# EAGLE design usb_power (EAGLE 7.7.0)
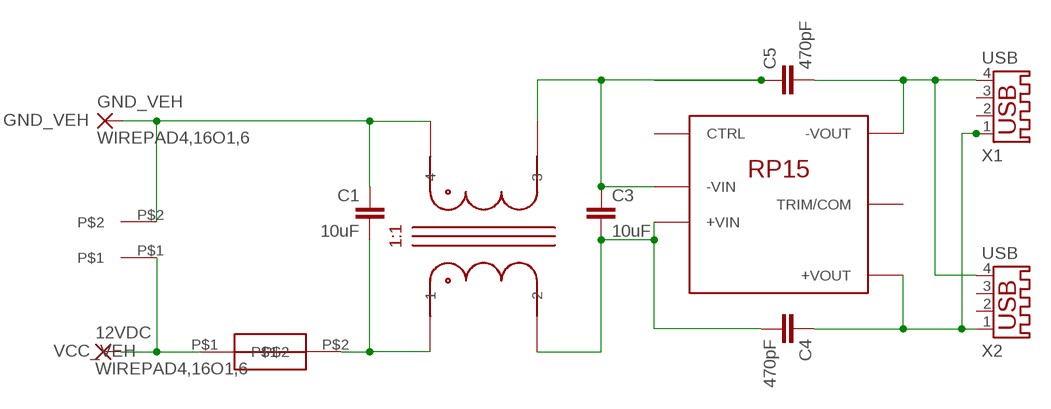
[diagram p0: schematic, sheet 1]

## Parts
12VDC  WIREPAD4,16O1,6  [4,16O1,6]
C1  10uF  C-EUC1812  [C1812]
C3  10uF  C-EUC1812  [C1812]
C4  470pF  C-EUC1808  [C1808]
C5  470pF  C-EUC1808  [C1808]
GND_VEH  WIREPAD4,16O1,6  [4,16O1,6]
RECOM  RP15-1205SA  [RP15]
U$2  1.6A  FUSE  [C1608]
U$3  COMMON-MODE-CHOKE  [CMS2]
U$4  POWERPOLE_RIGHT  [1336G1]
X1  USB  USB-A003  [USB-A003]
X2  USB  USB-A003  [USB-A003]

## Nets
GND_VEH: C1.1 GND_VEH.1(P) U$3.4 U$4.P$2
N$3: C1.2 U$2.P$2 U$3.1
N$4: C3.1 C5.1 RECOM.-VIN U$3.3
N$8: C3.2 C4.2 RECOM.+VIN U$3.2
N$12: C5.2 RECOM.-VOUT X1.4 X2.4
VCC_ISO: C4.1 RECOM.+VOUT X1.1 X2.1
VCC_VEH: 12VDC.1(P) U$2.P$1 U$4.P$1
Unconnected: RECOM.CTRL RECOM.TRIM/COM X1.2 X1.3 X2.2 X2.3

## Library data of the parts
12VDC GND_VEH = wirepad:WIREPAD: Wire PAD connect wire on PCB
C1 C3-C5 = resistor:C-EU: CAPACITOR, European symbol
RECOM = doug-custom:RP15-1205SA: RP15-1205SA isolated DC/DC converter 9-18 VDC input 5 VDC output, 3,000 mA / 15W max
U$2 = doug-custom:FUSE: FUSE
U$3 = doug-custom:COMMON-MODE-CHOKE: common mode choke Eaton CMS2 surface mount
U$4 = doug-custom:POWERPOLE_RIGHT: right angle powerpole connector, pcb mount
X1 X2 = con-yamaichi:USB-A003: USB connector; OC_FARNELL: unknown; OC_NEWARK: unknown

## Board
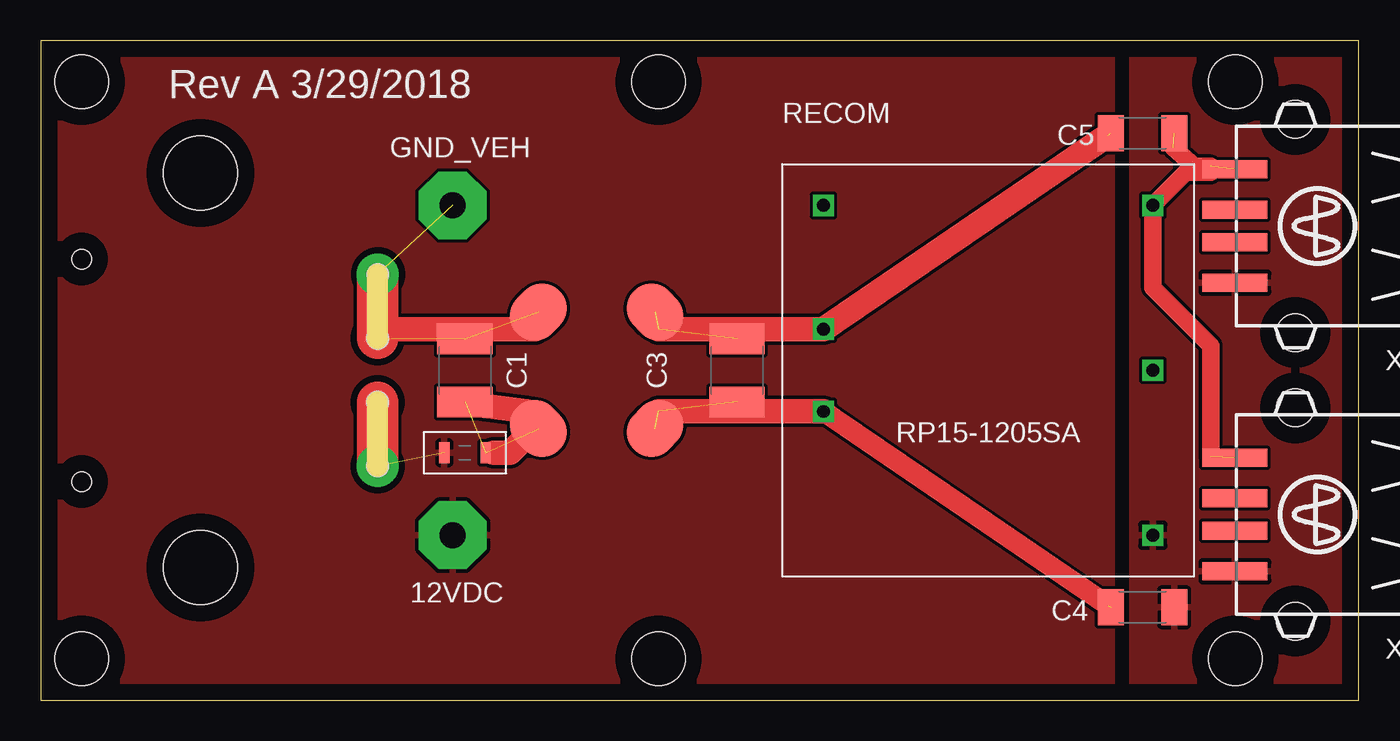
[diagram p1: board, top side]
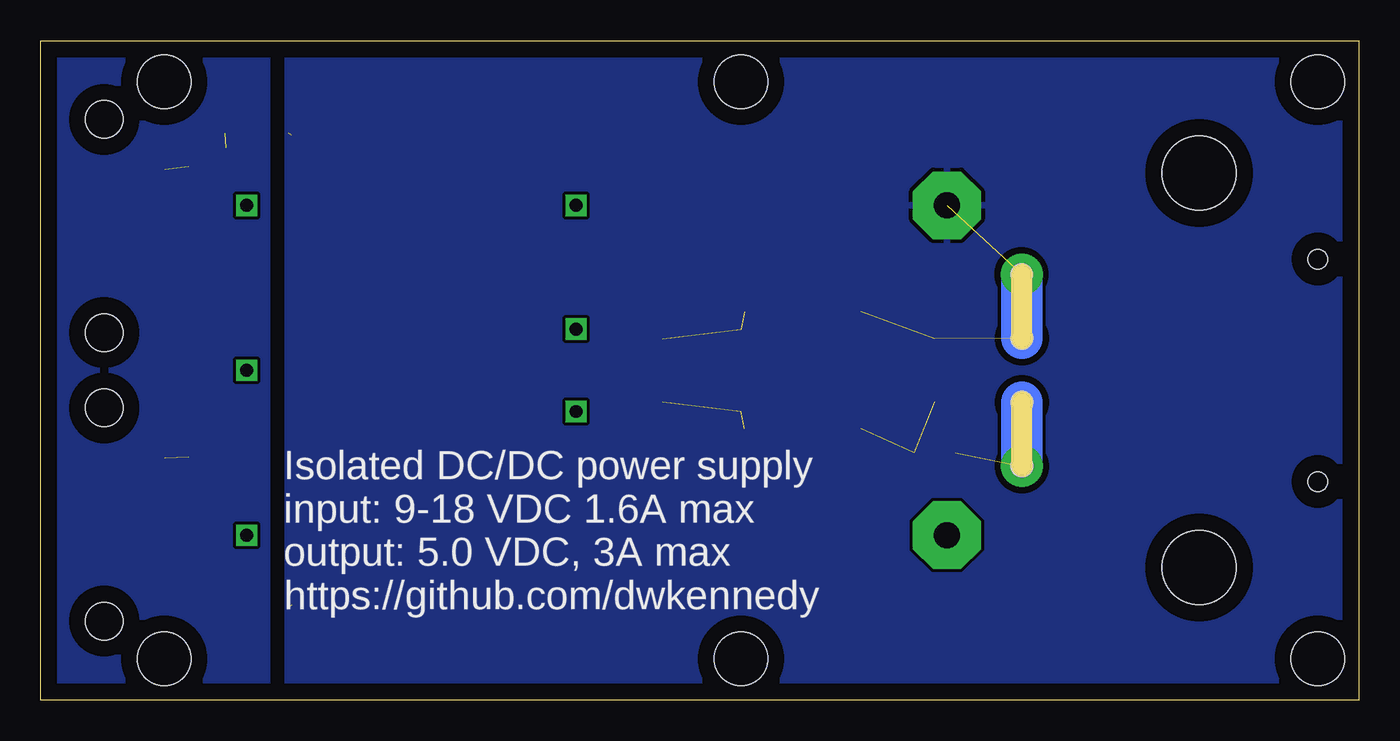
[diagram p2: board, bottom side, seen from below]

Size 81.28 x 40.64 mm. Coordinates in mm from the lower left corner, seen from the top.
Outline: 0,0 81.26,0 81.28,40.64 0,40.64 0,0
Copper layers (1*16): Top 0.035mm / dielectric 1.5mm / Bottom 0.035mm
Design rules "default": minimum track width 10mil, minimum drill 24mil, track to track 8mil, track to pad 8mil, pad to pad 8mil, via to via 8mil, smd to smd 8mil, copper to edge 40mil, drill to drill 8mil, minimum pad ring 10mil, minimum via ring 8mil, stop-mask expansion 4mil, vias tented up to drill 0mil, thermal gap 10mil
Holes 3.26 mm at 2.54,38.1 2.54,2.54 73.66,2.54 73.66,38.1 38.1,38.1 38.1,2.54

### Footprints (pad centres in the part's own frame; a part is rotated, then mirrored left to right if it is on the bottom)
4,16O1,6 = drill 1.6 pad 4.166 octagon: 1 0,0
C1812 = smd 1.9 x 3.4: 1 -1.95,0; 2 1.95,0
C1808 = smd 1.6 x 2.2: 1 -1.95,0; 2 1.95,0
RP15 = drill 0.8 square: +VIN -10.16,-2.54; +VOUT 10.16,-10.16; -VIN -10.16,2.54; -VOUT 10.16,10.16; CTRL -10.16,10.16; TRIM/COM 10.16,0
C1608 = smd 0.635 x 1.27: P$1 -1.27,0; P$2 1.27,0
CMS2 = smd 3.048 x 3.683: 1 -5.08,0; 3 5.08,0 | smd 3.683 x 3.048: 2 0,-5.08; 4 0,5.08
1336G1 = drill 1.3 pad 2.565: P$1 -5.905,-18.237; P$2 5.905,-18.237 | hole 1.3: -5.905,-18.237; -1.968,-18.237; 1.968,-18.237; 5.905,-18.263 | hole 1.194: -6.858,0; 6.858,0 | hole 4.572: -12.154,-7.315; 12.154,-7.315
USB-A003 = smd 1.12 x 4: 1 -3.5,14; 2 -1,14; 3 1,14; 4 3.5,14 | hole 2.3: -6.57,10.28; 6.57,10.28

### Placement (x,y rotation side)
12VDC  25.4,10.16 0 top
C1  26.16,20.32 270 top
C3  42.93,20.32 270 top
C4  67.94,5.71 180 top
C5  67.94,34.92 0 top
GND_VEH  25.4,30.48 0 top
RECOM  58.42,20.32 0 top
U$2  26.16,15.24 0 top
U$3  34.29,20.32 45 top
U$4  2.54,20.32 90 top
X1  87.63,29.21 90 top
X2  87.63,11.43 90 top

### Tracks (layer width: path | path; a pad name or v marks a point on that pad's centre or on a via)
GND_ISO
  pour Bottom: 67.31,40.64 67.31,0 81.28,0 81.28,40.64
GND_VEH  (3 unrouted)
  pour Bottom: 0,40.64 66.04,40.64 66.04,0 0,0
N$1
  Top 1.524: 20.32,22.86 30.48,22.86
N$3  (2 unrouted)
N$4  (3 unrouted)
  Top 1.524: 65.79,34.8 RECOM.-VIN 38.1,22.86
N$8  (3 unrouted)
  Top 1.27: RECOM.+VIN 65.79,5.84
  Top 1.524: RECOM.+VIN 38.1,17.78
N$9
  Top 1.524: 30.48,16.76 28.96,15.24 27.94,15.24
N$10
  Top 1.524: 26.16,18.29 29.97,17.78
N$12  (3 unrouted)
  Top 1.079: 72.14,14.99 72.14,21.84 68.58,25.4 RECOM.-VOUT 70.61,32.51 72.14,32.51 72.14,32.89 71.12,32.89 69.85,34.04
VCC_ISO
  pour Top: 67.31,40.64 67.31,0 81.28,0 81.28,40.64
VCC_VEH  (1 unrouted)
  pour Top: 0,40.64 66.04,40.64 66.04,0 0,0

### Text on the board
tPlace: Rev A 3/29/2018
bPlace: Isolated DC/DC power supply / input: 9-18 VDC 1.6A max / output: 5.0 VDC, 3A max / https://github.com/dwkennedy